# EAGLE design EVAL_51296_V2 (EAGLE 7.7.0)

## Sheet 1 of 2
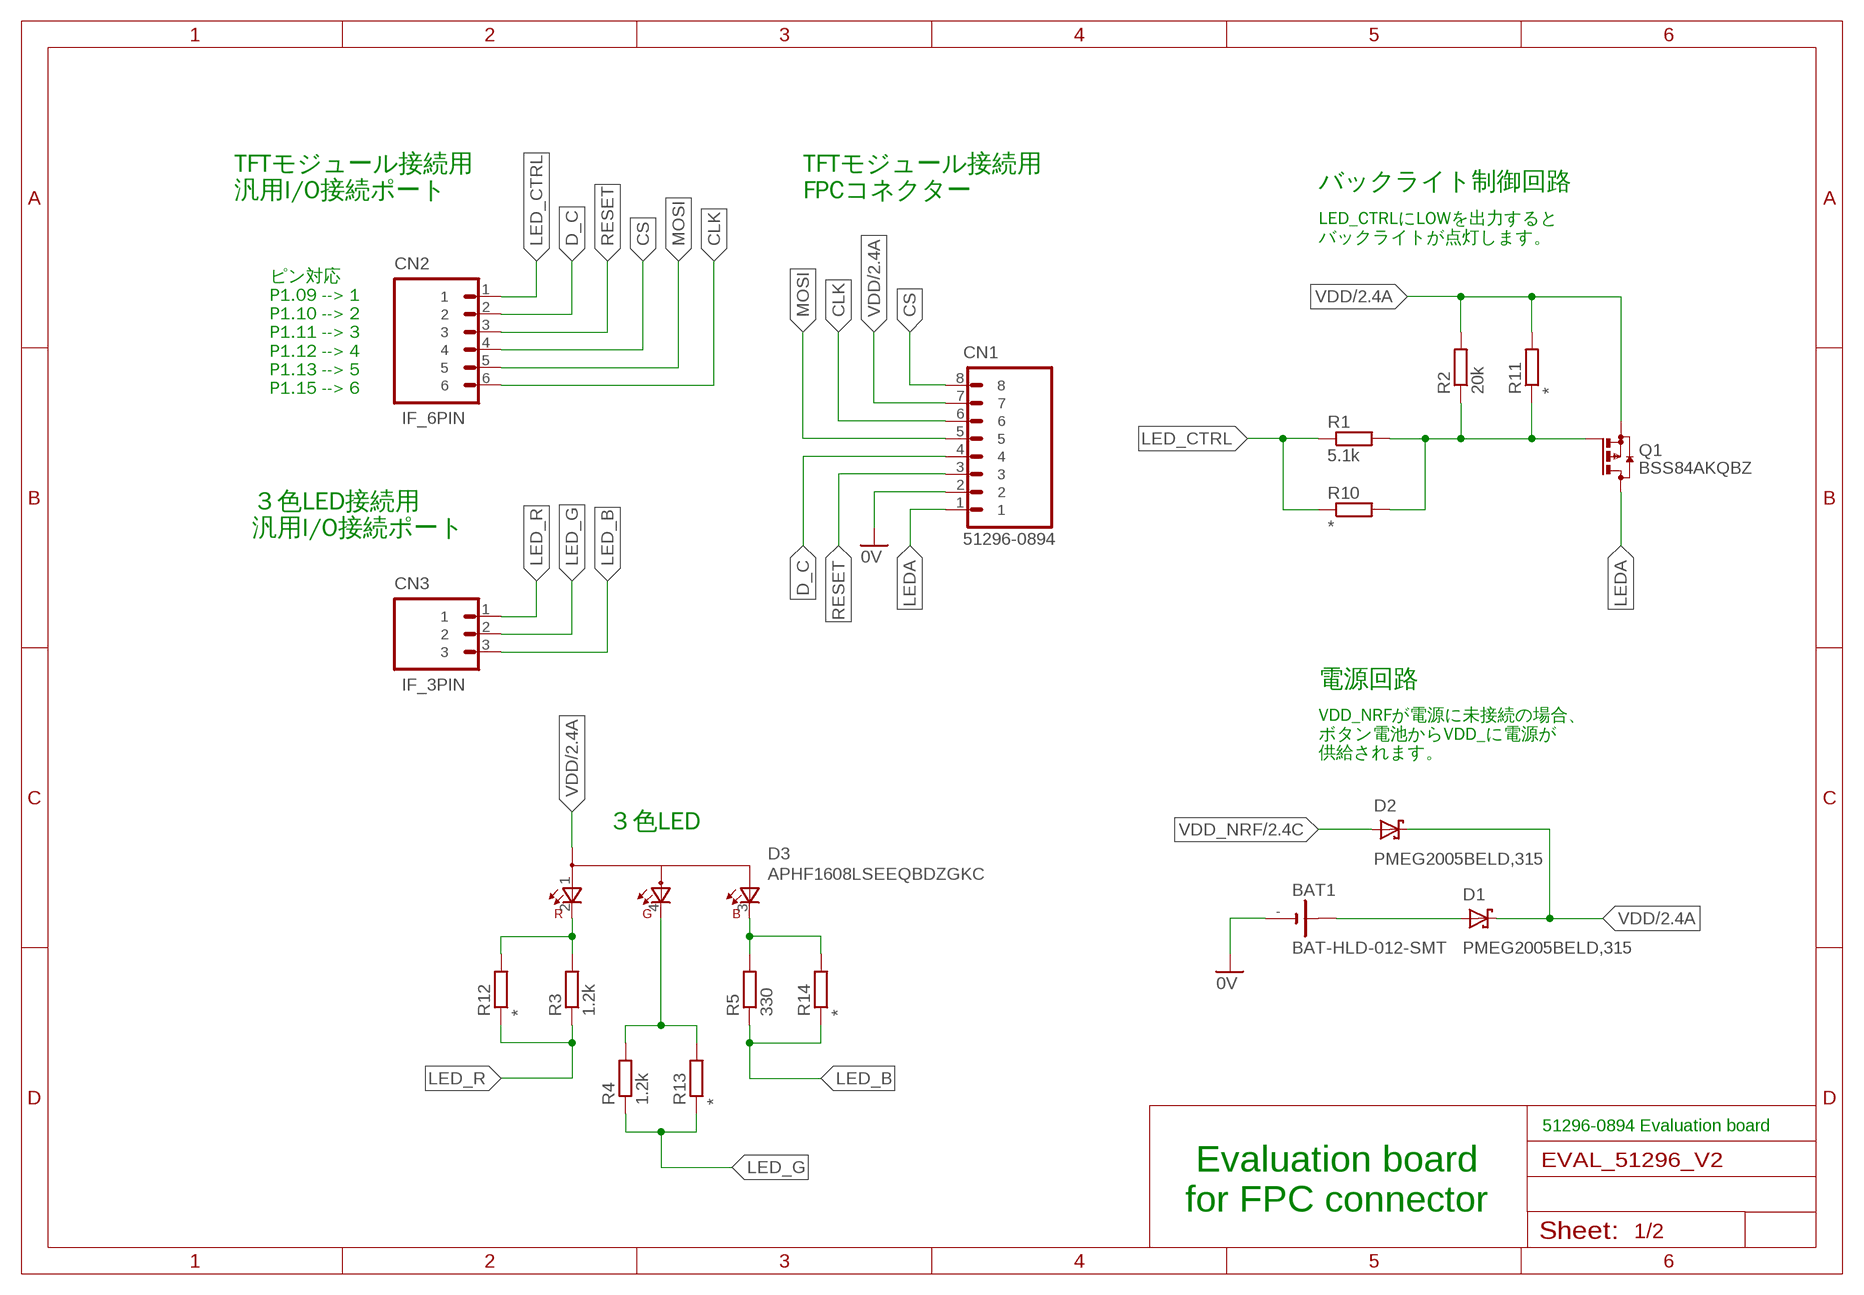
[diagram p0: schematic, sheet 1]

### Parts
BAT1  BAT-HLD-012-SMT  [BAT-HLD-012-SMT]
CN1  51296-0894  [51296-0894]
CN2  IF_6PIN  [HEADER_6PIN]
CN3  IF_3PIN  [HEADER_3PIN]
D1  PMEG2005BELD,315  [DFN1006D-2]
D2  PMEG2005BELD,315  [DFN1006D-2]
D3  APHF1608LSEEQBDZGKC  [APHF1608LSEEQBDZGKC]
Q1  BSS84AKQBZ  [BSS84AKQB]
R1  5.1k  RESISTOR_0402N  [R0402N]
R2  20k  RESISTOR_0402N  [R0402N]
R3  1.2k  RESISTOR_0402N  [R0402N]
R4  1.2k  RESISTOR_0402N  [R0402N]
R5  330  RESISTOR_0402N  [R0402N]
R10  *  RESISTOR_200MIL  [RESISTOR_0204_200MIL]
R11  *  RESISTOR_200MIL  [RESISTOR_0204_200MIL]
R12  *  RESISTOR_200MIL  [RESISTOR_0204_200MIL]
R13  *  RESISTOR_200MIL  [RESISTOR_0204_200MIL]
R14  *  RESISTOR_200MIL  [RESISTOR_0204_200MIL]

### Nets
0V: BAT1.- CN1.2 ; also sheet 2
CLK: CN1.6 CN2.6
CS: CN1.8 CN2.4
D_C: CN1.4 CN2.2
LED_B: CN3.3 R5.1 R14.1
LED_CTRL: CN2.1 R1.1 R10.1
LED_G: CN3.2 R4.1 R13.1
LED_R: CN3.1 R3.1 R12.1
LEDA: CN1.1 Q1.3(D)
MOSI: CN1.5 CN2.5
N$1: Q1.1(G) R1.2 R2.1 R10.2 R11.1
N$2: BAT1.+@2(+) D1.2(A)
N$6: D3.2(CRED) R3.2 R12.2
N$9: D3.4(CGREEN) R4.2 R13.2
N$10: D3.3(CBLUE) R5.2 R14.2
RESET: CN1.3 CN2.3
VDD: CN1.7 D1.1(C) D2.1(C) D3.1(A) Q1.2(S) R2.2 R11.2 ; also sheet 2
VDD_NRF: D2.2(A) ; also sheet 2

### Notes on the sheet
- TFTモジュール接続用
  汎用I/O接続ポート
- TFTモジュール接続用
  FPCコネクター
- バックライト制御回路
- LED_CTRLにLOWを出力すると
  バックライトが点灯します。
- ピン対応
  P1.09 --> 1
  P1.10 --> 2
  P1.11 --> 3
  P1.12 --> 4
  P1.13 --> 5
  P1.15 --> 6
- ３色LED接続用
  汎用I/O接続ポート
- 電源回路
- VDD_NRFが電源に未接続の場合、
  ボタン電池からVDD_に電源が
  供給されます。
- ３色LED
- 51296-0894 Evaluation board
- Evaluation board
  for FPC connector

## Sheet 2 of 2
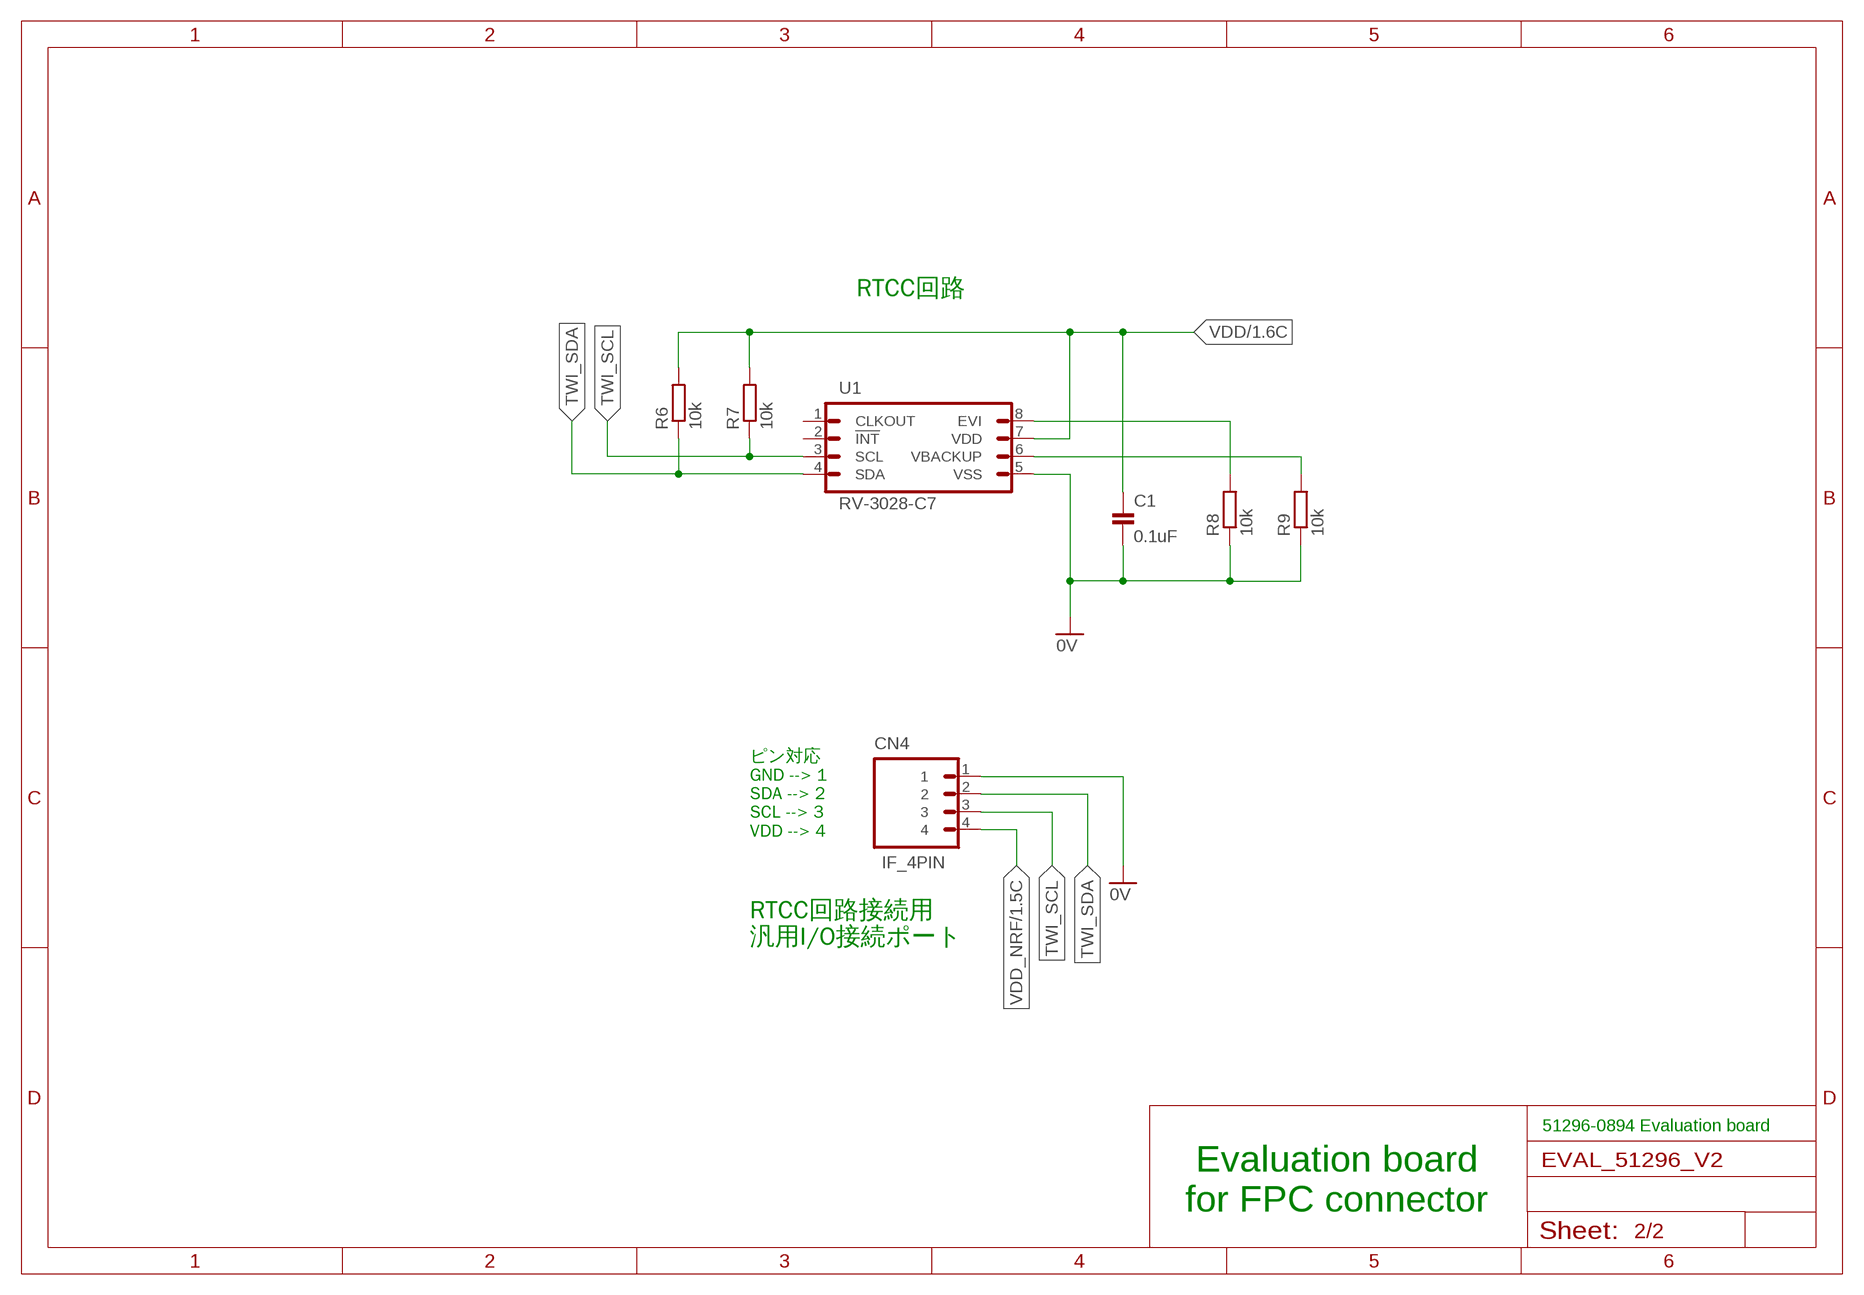
[diagram p1: schematic, sheet 2]

### Parts
C1  0.1uF  CAP_0402N  [C0402N]
CN4  IF_4PIN  [HEADER_4PIN]
R6  10k  RESISTOR_0402N  [R0402N]
R7  10k  RESISTOR_0402N  [R0402N]
R8  10k  RESISTOR_0402N  [R0402N]
R9  10k  RESISTOR_0402N  [R0402N]
U1  RV-3028-C7  [SON-8]

### Nets
0V: C1.2 CN4.1 R8.1 R9.1 U1.5(VSS) ; also sheet 1
N$3: R9.2 U1.6(VBACKUP)
N$4: R8.2 U1.8(EVI)
TWI_SCL: CN4.3 R7.1 U1.3(SCL)
TWI_SDA: CN4.2 R6.1 U1.4(SDA)
VDD: C1.1 R6.2 R7.2 U1.7(VDD) ; also sheet 1
VDD_NRF: CN4.4 ; also sheet 1
Unconnected: U1.1(CLKOUT) U1.2(!INT!)

### Notes on the sheet
- RTCC回路
- ピン対応
  GND --> 1
  SDA --> 2
  SCL --> 3
  VDD --> 4
- RTCC回路接続用
  汎用I/O接続ポート
- 51296-0894 Evaluation board
- Evaluation board
  for FPC connector

## Library data of the parts
BAT1 = Connectors:BAT-HLD-012-SMT: ボタン電池ホルダー(CR1216/1225)
C1 = Parts:CAP: コンデンサー
CN1 = Connectors:51296-0894: 0.5mm-8pins FFC & FPC Connector Right Angle, Bottom Contact
CN2 = Connectors:IF_6PIN: 6-pin インターフェース
CN3 = Connectors:IF_3PIN: 3-pin インターフェース
CN4 = Connectors:IF_4PIN: 4-pin インターフェース
D1 D2 = Parts:PMEG2005: ショットキーダイオード If - 順電流: 500 mA Vrrm - 繰返し逆電圧: 20 V Vf - 順電圧: 0.39 V Ifsm - 順方向サージ電流: 10 A 最低動作温度: - 65 C 最高動作温度: + 150 C
D3 = Parts:APHF1608: 1.6 x 0.8 mm Full-Color Surface Mount LED
Q1 = Parts:BSS84AKQB: P-Channel MOSFET DFN-1110D-3
R1-R14 = Parts:RESISTOR: 抵抗器
U1 = ICs:RV-3028-C7: Extreme Low Power RTC Module Supply Voltage: 1.2 V 〜 5.5 V Operating Temperature: - 40 C 〜 + 85 C 3.2 mm x 1.5 mm

## Board
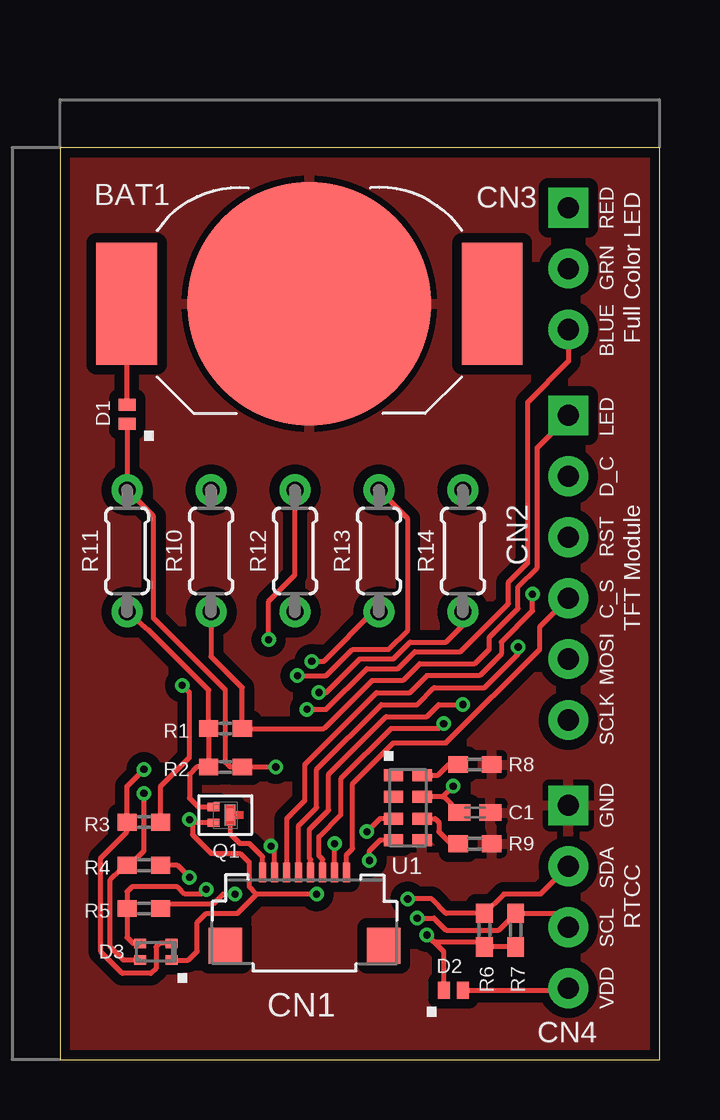
[diagram p2: board, top side]
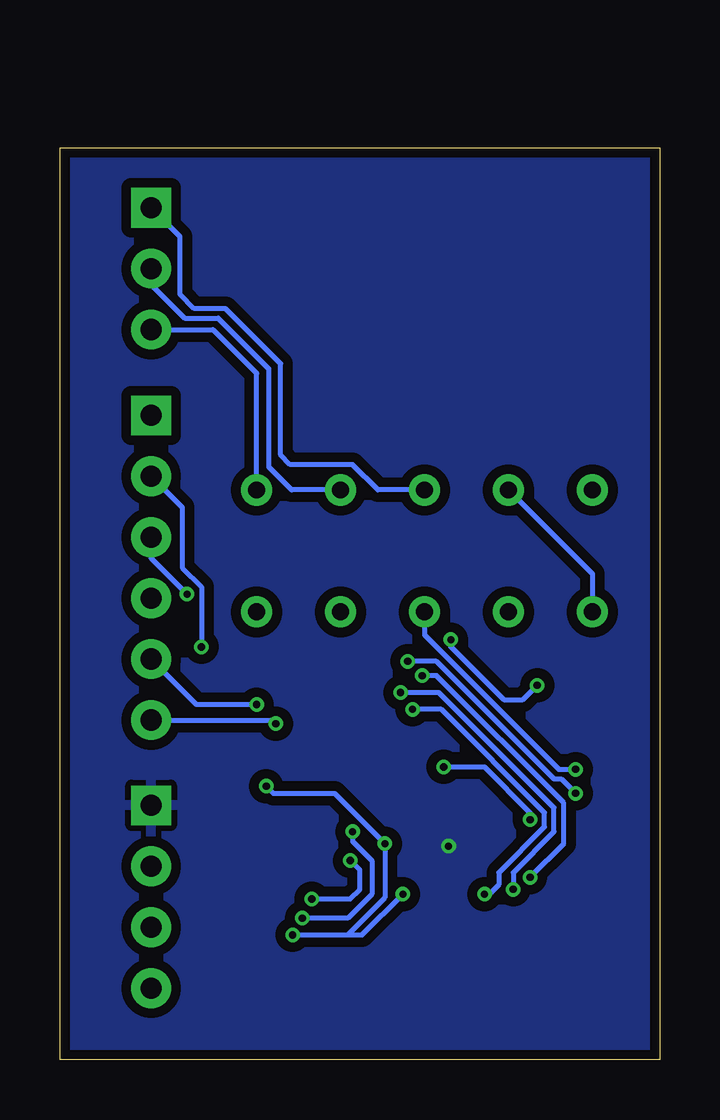
[diagram p3: board, bottom side, seen from below]

Size 25 x 38 mm. Coordinates in mm from the lower left corner, seen from the top.
Outline: 0,0 25,0 25,38 0,38 0,0
Copper layers (1*16): Top 0.035mm / dielectric 1.5mm / Bottom 0.035mm
Design rules "SeeedStudio_2layer_DRU_no_angle_20140221 *": minimum track width 6mil, minimum drill 0.3mm, track to track 6mil, track to pad 6mil, pad to pad 6mil, via to via 6mil, smd to smd 0mil, copper to edge 10mil, drill to drill 10mil, minimum pad ring 10mil, minimum via ring 6mil, stop-mask expansion 2mil, vias tented up to drill 100mil, thermal gap 10mil

### Footprints (pad centres in the part's own frame; a part is rotated, then mirrored left to right if it is on the bottom)
BAT-HLD-012-SMT = smd 2.54 x 5.08: +@1 -7.62,0; +@2 7.62,0 | smd 10.16 x 10.16: - 0,0
C0402N = smd 0.925 x 0.7: 1 -0.65,0; 2 0.65,0
51296-0894 = smd 0.28 x 0.8: 1 -1.75,3.8; 2 -1.25,3.8; 3 -0.75,3.8; 4 -0.25,3.8; 5 0.25,3.8; 6 0.75,3.8; 7 1.25,3.8; 8 1.75,3.8 | smd 1.4 x 1.5: FG1 -3.3,0.75; FG2 3.3,0.75
HEADER_6PIN = drill 0.889 pad 1.651 square: 1 -6.35,0 | drill 0.889 pad 1.651: 2 -3.81,0; 3 -1.27,0; 4 1.27,0; 5 3.81,0; 6 6.35,0
HEADER_3PIN = drill 0.889 pad 1.651 square: 1 0,0 | drill 0.889 pad 1.651: 2 2.54,0; 3 5.08,0
HEADER_4PIN = drill 0.889 pad 1.651 square: 1 0,0 | drill 0.889 pad 1.651: 2 2.54,0; 3 5.08,0; 4 7.62,0
DFN1006D-2 = smd 0.5 x 0.7: 1 -0.4,0; 2 0.4,0
APHF1608LSEEQBDZGKC = smd 0.5 x 0.4: 1 -0.65,0.35; 2 -0.65,-0.35; 3 0.65,-0.35; 4 0.65,0.35
BSS84AKQB = smd 0.35 x 0.5: 1 0.325,0.5; 2 -0.325,0.5 | smd 0.5 x 0.3: 3 0,-0.19
R0402N = smd 0.8 x 0.7: 1 -0.7,0; 2 0.7,0
RESISTOR_0204_200MIL = drill 0.7 pad 1.3: 1 -2.54,0; 2 2.54,0
SON-8 = smd 0.5 x 0.8: 1 0.25,0.4; 2 1.15,0.4; 3 2.05,0.4; 4 2.95,0.4; 5 2.95,1.6; 6 2.05,1.6; 7 1.15,1.6; 8 0.25,1.6

### Placement (x,y rotation side)
BAT1  10.4,31.5 180 top
C1  17.3,10.3 0 top
CN1  10.2,4 0 top
CN2  21.2,20.5 270 top
CN3  21.2,35.5 270 top
CN4  21.2,10.6 270 top
D1  2.8,26.9 90 top
D2  16.4,2.9 0 top
D3  4,4.5 180 top
Q1  6.9,10.2 90 top
R1  6.9,13.8 180 top
R2  6.9,12.2 0 top
R3  3.5,9.9 180 top
R4  3.5,8.1 180 top
R5  3.5,6.3 180 top
R6  17.7,5.4 270 top
R7  19,5.4 270 top
R8  17.3,12.3 180 top
R9  17.3,9 180 top
R10  6.3,21.2 90 top
R11  2.8,21.2 90 top
R12  9.8,21.2 270 top
R13  13.3,21.2 270 top
R14  16.8,21.2 270 top
U1  13.5,12.1 270 top

### Tracks (layer width: path | path; a pad name or v marks a point on that pad's centre or on a via)
0V  (via drill 0.3)
  Top 0.203: CN1.2 8.95,8.75 v8.8,8.9
  pour Top (isolate 0.406, rank 3): -1,39 26,39 26,-1 -1,-1
  pour Bottom (isolate 0.406, rank 3): -2,40 27,40 27,-2 -2,-2
CLK  (via drill 0.3)
  Top 0.203: v16,14 15.8,13.8 13.8,13.8 11.7,11.7 11.7,10.2 10.8,9.3 10.8,8.5 10.95,8.35 CN1.6
  Bottom 0.203: CN2.6 16.15,14.15 v16,14
CS
  Top 0.203: CN1.8 11.95,8.55 12.2,8.8 12.2,11.5 13.9,13.2 16.1,13.2 20,17.1 20,18.03 CN2.4
D_C  (via drill 0.3)
  Top 0.203: CN1.4 9.95,9.75 10.7,10.5 10.7,12.1 13.4,14.8 14.9,14.8 15.6,15.5 17.7,15.5 19.1,16.9 v19.1,17.2
  Bottom 0.203: CN2.2 19.9,23.01 19.9,20.5 19.1,19.7 v19.1,17.2
LED_B  (via drill 0.3)
  Top 0.203: v10.3,14.6 11.1,14.6 12.8,16.3 14.1,16.3 14.8,17 16.7,17 18.7,19 18.7,19.9 19.5,20.7 19.5,27.4 21.2,29.1 CN3.3 | R5.1 4.4,6.5 6.4,6.5 6.8,6.9 v7.3,6.9
  Bottom 0.203: v10.3,14.6 9.1,14.6 4.8,10.3 4.8,9.7 6.7,7.8 6.7,7.3 7.1,6.9 v7.3,6.9 | CN3.3 18.62,30.42 16.8,28.6 R14.1
LED_CTRL
  Top 0.203: CN2.1 21.2,26.8 19.9,25.5 19.9,20.5 19.1,19.7 19.1,18.8 17.9,17.6 17.9,17.1 17.3,16.5 15,16.5 14.3,15.8 13,15.8 11,13.8 R1.1 7.6,15.5 6.3,16.8 R10.1
LED_G  (via drill 0.3)
  Top 0.203: v9.9,16 11.1,16 12.2,17.1 13.7,17.1 14.5,17.9 14.5,22.54 R13.1 | v5.4,7.6 4.9,8.1 R4.1
  Bottom 0.203: CN3.2 21.2,32.3 19.8,30.9 18.4,30.9 16.3,28.8 16.3,24.7 15.34,23.74 R13.1 | v9.9,16 9.3,16 4,10.7 4,9 v5.4,7.6
LED_R  (via drill 0.3)
  Top 0.203: R3.1 4.2,11.4 5.4,12.6 5.4,15.3 v5.1,15.6 | v8.7,17.5 8.7,19.1 9.8,20.2 R12.1
  Bottom 0.203: R12.1 11.74,23.74 12.8,24.8 15.4,24.8 15.8,25.2 15.8,29 18.1,31.3 19.4,31.3 20,31.9 20,34.3 CN3.1 | v5.1,15.6 5.7,15 6.5,15 8.7,17.2 v8.7,17.5
LEDA
  Top 0.203: CN1.1 8.45,8.45 7.9,9 7.5,9 7.09,9.41 Q1.3
MOSI  (via drill 0.3)
  Top 0.203: CN1.5 10.45,8.35 10.4,8.4 10.4,9.6 11.2,10.4 11.2,11.9 13.6,14.3 15.3,14.3 15.8,14.8 v16.8,14.8
  Bottom 0.203: v16.8,14.8 19.31,14.8 CN2.5
N$1
  Top 0.203: Q1.1 5.78,10.53 5.4,10.9 5.4,11.9 5.7,12.2 R2.1 R1.2 6.2,15.4 3.7,17.9 R11.1
  Bottom 0.203: R10.2 2.8,20.24 R11.1
N$2
  Top 0.203: BAT1.+@2 2.78,27.32 D1.2
N$3
  Top 0.203: R9.2 16.3,9 15.8,9.5 15.8,9.9 15.65,10.05 U1.6
N$4
  Top 0.203: R8.2 16.2,12.3 15.75,11.85 U1.8
N$6  (via drill 0.3)
  Top 0.203: D3.2 4.15,4.85 4,4.7 4,3.8 3.8,3.6 2.6,3.6 1.7,4.5 1.7,8.4 2.8,9.5 R3.2 2.8,11.4 v3.5,12.1
  Bottom 0.203: R12.2 9.8,17.7 4.2,12.1 v3.5,12.1
N$9  (via drill 0.3)
  Top 0.203: D3.4 2.65,4.15 2.1,4.7 2.1,7.5 2.5,7.9 R4.2 2.9,8.1 3.5,8.7 v3.5,11.1 | v10.5,16.6 11,16.6 13.06,18.66 R13.2
  Bottom 0.203: v10.5,16.6 9.3,16.6 4.4,11.7 4.1,11.7 v3.5,11.1
N$10  (via drill 0.3)
  Top 0.203: v10.8,15.3 11.1,15.3 12.5,16.7 13.9,16.7 14.6,17.4 16.1,17.4 16.8,18.1 R14.2 | D3.3 3.05,4.85 2.8,5.1 R5.2 2.8,7 3,7.2 4.9,7.2 5.2,6.9 5.9,6.9 v6.1,7.1
  Bottom 0.203: v10.8,15.3 9.2,15.3 4.4,10.5 4.4,9.5 6.1,7.8 v6.1,7.1
RESET  (via drill 0.3)
  Top 0.203: CN1.3 9.45,10.05 10.2,10.8 10.2,12.3 13.2,15.3 14.6,15.3 15.3,16 17.5,16 18.4,16.9 18.4,17.4 19.7,18.7 v19.7,19.4
  Bottom 0.203: CN2.3 21.2,20.9 v19.7,19.4
TWI_SCL  (via drill 0.3)
  Top 0.203: U1.3 13.35,10.05 v12.8,9.5 | v14.9,5.9 15.6,5.9 16.1,5.4 18.3,5.4 R7.1 20.62,6.1 CN4.3
  Bottom 0.203: v12.8,9.5 12.8,9.1 12,8.3 12,6.9 13,5.9 v14.9,5.9
TWI_SDA  (via drill 0.3)
  Top 0.203: U1.4 13.35,9.15 12.9,8.7 v12.9,8.3 | v14.5,6.7 15.5,6.7 16.1,6.1 R6.1 18.5,6.9 20.04,6.9 CN4.2
  Bottom 0.203: v14.5,6.7 12.9,6.7 12.5,7.1 12.5,7.9 v12.9,8.3
VDD  (via drill 0.3)
  Top 0.203: CN1.7 v11.45,9 | 15.95,10.95 v16.4,11.4 | D3.1 5.35,4.15 5.72,4.53 5.72,5.72 6.1,6.1 7.4,6.1 8.2,6.9 | 15.95,10.95 U1.7 | D2.1 16,4.5 v15.3,5.2 15.6,4.9 17.5,4.9 R6.2 R7.2 | 15.95,10.95 16,10.95 C1.1 | D1.1 R11.2 3.9,22.64 3.9,18.4 6.9,15.4 6.9,12.4 7.1,12.2 R2.2 v9,12.2 | Q1.2 5.53,9.88 | 5.53,9.88 v5.4,10 | 5.53,9.88 5.53,9.38 6.3,8.6 7.5,8.6 7.9,8.2 7.9,7.2 8.2,6.9 | v10.7,6.9 8.2,6.9
  Bottom 0.203: v15.3,5.2 13,5.2 | 13,5.2 11.45,6.75 v11.45,9 13.55,11.1 16.1,11.1 v16.4,11.4 | 13,5.2 12.4,5.2 v10.7,6.9 | v9,12.2 7.3,12.2 5.4,10.3 v5.4,10
VDD_NRF
  Top 0.203: 16.82,2.88 D2.2 21.12,2.9 CN4.4

### Text on the board
tPlace: RED | GRN | Full Color LED | BLUE | LED | D_C | RST | TFT Module | C_S | MOSI | SCLK | GND | SDA | RTCC | SCL | VDD